# Altium project DataloggerV3.x_Mainboard.PrjPcb (part 2 of 2)

## Sheet Inverted_HS_LS_switch_HI_PWR.SchDoc: Data Logger - Inverted HS LS Hi Power Switches
size A4; DocumentNumber: DL-MB-10; Revision: 3.2.1B; SheetNumber: 10; SheetTotal: 11
Used 4 times, as channels Arduino_2560_schematics/ISA - Arduino Option Inverted Switches/ISA3, Arduino_2560_schematics/ISA - Arduino Option Inverted Switches/ISA4, Arduino_2560_schematics/ISA - Arduino Option Inverted Switches/ISA1, Arduino_2560_schematics/ISA - Arduino Option Inverted Switches/ISA2. Parts and nets are listed once, with the designators drawn on the sheet.
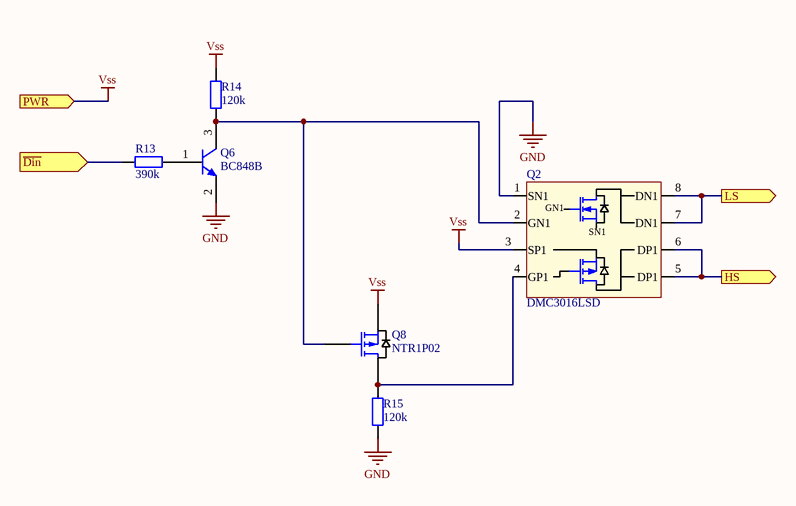
[diagram p7: Inverted_HS_LS_switch_HI_PWR.SchDoc]

### Parts
Q2  DMC3016LSD  [SOIC-8_SOIC127P600X175-8N]
Q6  BC848B  [SOT23_N]
Q8  NTR1P02  [SOT23_N]
R13  390k  [RES-1206_M]
R14  120k  [RES-1206_M]
R15  120k  [RES-1206_M]

### Ports
HS (out), LS (out), PWR (in), ~{Din} (in)

### Nets
GND: Q2.1(SN1) Q6.2(E) R15.2
Vss: Q2.3(SP1) Q8.2(S) R14.2 ; port PWR
~{Din}: R13.1 ; port ~{Din}
HS: Q2.5(DP1) Q2.6(DP1) ; port HS
LS: Q2.7(DN1) Q2.8(DN1) ; port LS
NetQ2_2: Q2.2(GN1) Q6.3(C) Q8.1(G) R14.1
NetQ2_4: Q2.4(GP1) Q8.3(D) R15.1
NetQ6_1: Q6.1(B) R13.2

### Channels
Arduino_2560_schematics/ISA - Arduino Option Inverted Switches/ISA3: designators Q2=ISA3.Q2 Q6=ISA3.Q6 Q8=ISA3.Q8 R13=ISA3.R13 R14=ISA3.R14 R15=ISA3.R15; ports HS=INV_5V12V_HS_3 LS=INV_5V12V_LS_3 PWR=5V ~{Din}=RSW3
Arduino_2560_schematics/ISA - Arduino Option Inverted Switches/ISA4: designators Q2=ISA4.Q2 Q6=ISA4.Q6 Q8=ISA4.Q8 R13=ISA4.R13 R14=ISA4.R14 R15=ISA4.R15; ports HS=INV_5V12V_HS_4 LS=INV_5V12V_LS_4 PWR=5V ~{Din}=RSW4
Arduino_2560_schematics/ISA - Arduino Option Inverted Switches/ISA1: designators Q2=ISA1.Q2 Q6=ISA1.Q6 Q8=ISA1.Q8 R13=ISA1.R13 R14=ISA1.R14 R15=ISA1.R15; ports HS=INV_5V12V_HS_1 LS=INV_5V12V_LS_1 PWR=5V ~{Din}=RSW1
Arduino_2560_schematics/ISA - Arduino Option Inverted Switches/ISA2: designators Q2=ISA2.Q2 Q6=ISA2.Q6 Q8=ISA2.Q8 R13=ISA2.R13 R14=ISA2.R14 R15=ISA2.R15; ports HS=INV_5V12V_HS_2 LS=INV_5V12V_LS_2 PWR=5V ~{Din}=RSW2

### Notes on the sheet
- Title
- Size
- Date:
- A4
- Number
- Time:
- Sheet
- of
- Revision
- File:
- Drawn By:

### Library data of the parts
Q2 = DMC3016LSD: MOSFET N/P-CH 30V 8.2A/6.2A 8SO; Manufacturer: Diodes; Manufacturer Part Number: DMC3016LSD-13; Continuous Drain Current (ID): 6.2A; Rds On Max: 16mR; Input Capacitance: 1.415nF; Max Power Dissipation: 1.2W; Number of Channels: 2; Drain to Source Resistance: 30mR; Gate to Source Voltage (Vgs): 20V; Fall Time: 40.4ns; Rise Time: 17.1ns; Turn-Off Delay Time: 60.5ns; Turn-On Delay Time: 9.7ns; FET Type: N and P-Channel; RoHS: Yes; Category: MOSFETs; Mount: Surface Mount; Case/Package: SOIC; Number of Pins: 8; Weight: 0.00261oz; Min Operating Temperature: -55°C; Max Operating Temperature: 150°C; Packaging: Tape and Reel; Drain to Source Voltage (Vdss): 30V; Drain to Source Breakdown Voltage: 30V; Package Quantity: 2500; Lead Free: Lead Free; RoHS Compliant: Yes; ComponentLink1URL: http://www.mouser.com/ds/2/115/DMC3016LSD-364397.pdf?src-supplier=Mouser; ComponentLink1Description: http://www.mouser.com/ds/2/115/DMC3016LSD-364397.pdf?src-supplier=Mouser; ComponentLink2URL: https://www.diodes.com/assets/Datasheets/DMC3016LSD.pdf?src-supplier=Digi-Key; ComponentLink2Description: https://www.diodes.com/assets/Datasheets/DMC3016LSD.pdf?src-supplier=Digi-Key
Q6 = BC848B: NPN Silicon AF Transistor, 30 V VCEO, 100 mA IC, SOT23, Reel, Green; Manufacturer: Infineon; fT (typ): 250 MHz; Green: TRUE; IBM (max): 200 mA; IC (max): 100 mA; ICBO (max): 15 nA; Ptot (max): 330 mW; VCBO (max): 30 V; VEBO (max): 6 V; PackageVersion: Apr-08; PackageReference: SOT23; PackageDescription: 3-Pin Small Outline Transistor Package, 1.3 x 2.9 mm Body, 0.95 mm Pitch; ICM (max): 200 mA; Packing: Reel; Polarity: NPN; VCEO (max): 30 V; Mounting Technology: Surface Mount; PartNumber: BC848B; ComponentLink1Description: Manufacturer URL; ComponentLink1URL: http://www.infineon.com/; ComponentLink2Description: Datasheet; ComponentLink2URL: http://www.infineon.com/dgdl/bc847series_bc848series_bc849series_bc850series.pdf?folderId=db3a304314dca389011541d30fa21656&fileId=db3a304314dca389011541d4630a1657; ComponentLink3Description: Package Specification; ComponentLink3URL: http://www.infineon.com/dgdl/SOT23-Package_Overview.pdf?folderId=db3a30431936bc4b0119532290053c66&fileId=db3a30431936bc4b0119533468123c85
Q8 = MOSFET-P: NTR1P02T1G P-channel MOSFET Transistor; 1 A; 20 V; 3-Pin SOT-23; Manufacturer: ON Semiconductor; Rise Time: 9ns; Continuous Drain Current (ID): 1A; Gate to Source Voltage (Vgs): 20V; Power Dissipation: 400mW; Drain to Source Resistance: 148mR; Element Configuration: Single; Drain to Source Breakdown Voltage: -20V; Rds On Max: 180mR; Input Capacitance: 165pF; Current Rating: -1A; Number of Elements: 1; Turn-On Delay Time: 7ns; Threshold Voltage: -1.9V; Manufacturer Part Number: NTR1P02; RoHS: Yes; Category: MOSFETs; Case/Package: SOT-23-3; Number of Pins: 3; Contact Plating: Tin,Matte; Min Operating Temperature: -55°C; Max Operating Temperature: 150°C; Fall Time: 9ns; Turn-Off Delay Time: 9ns; Package Quantity: 1; Packaging: Tape and Reel; Max Power Dissipation: 400mW; Voltage Rating (DC): -20V; Drain to Source Voltage (Vdss): 20V; On-State Resistance: 148MR; Nominal Vgs: -1.9V; Length: 2.9mm; Width: 1.3mm; Height: 0.94mm; Radiation Hardening: No; RoHS Compliant: Yes; Lead Free: Lead Free; REACH SVHC: No SVHC; ComponentLink1URL: https://datasheet.ciiva.com/22641/1708311-22641684.pdf?src-supplier=Element14; ComponentLink1Description: https://datasheet.ciiva.com/22641/1708311-22641684.pdf?src-supplier=Element14; ComponentLink2URL: https://datasheet.ciiva.com/936/ntr1p02t1-d-936864.pdf?src-supplier=Digi-Key; ComponentLink2Description: https://datasheet.ciiva.com/936/ntr1p02t1-d-936864.pdf?src-supplier=Digi-Key; ComponentLink3URL: https://datasheet.ciiva.com/22641/1708311-22641686.pdf?src-supplier=Element14; ComponentLink3Description: https://datasheet.ciiva.com/22641/1708311-22641686.pdf?src-supplier=Element14; ComponentLink4URL: https://datasheet.ciiva.com/16386/ntr1p02t1-d-16386335.pdf?src-supplier=Future+Electronics; ComponentLink4Description: https://datasheet.ciiva.com/16386/ntr1p02t1-d-16386335.pdf?src-supplier=Future+Electronics; ComponentLink5URL: https://datasheet.ciiva.com/26145/ntr1p02t1-d-26145674.pdf?src-supplier=Avnet+Europe; ComponentLink5Description: https://datasheet.ciiva.com/26145/ntr1p02t1-d-26145674.pdf?src-supplier=Avnet+Europe; ComponentLink6URL: https://datasheet.ciiva.com/11168/ntr1p02t1-d-11168174.pdf?src-supplier=Avnet; ComponentLink6Description: https://datasheet.ciiva.com/11168/ntr1p02t1-d-11168174.pdf?src-supplier=Avnet; ComponentLink7URL: https://datasheet.ciiva.com/936/ntr1p02t1-d-936865.pdf?src-supplier=Digi-Key; ComponentLink7Description: https://datasheet.ciiva.com/936/ntr1p02t1-d-936865.pdf?src-supplier=Digi-Key
R13-R15 = Res2: Resistor; Published: 8-Jun-2000; LatestRevisionDate: 17-Jul-2002; LatestRevisionNote: Re-released for DXP Platform.; PackageReference: 1206; Publisher: Altium Limited; PackageDescription: Chip Resistor 1206 Case Size
  R13: Value: 390k
  R14 R15: Value: 120k

## Sheet HS_LS_switch_HI_PWR.SchDoc: Data Logger - HS LS HI Power Switches
size A4; DocumentNumber: DL-MB-7; Revision: 3.2.1B; SheetNumber: 7; SheetTotal: 11
Used 2 times, as channels Arduino_2560_schematics/SAO1, Arduino_2560_schematics/SAO2. Parts and nets are listed once, with the designators drawn on the sheet.
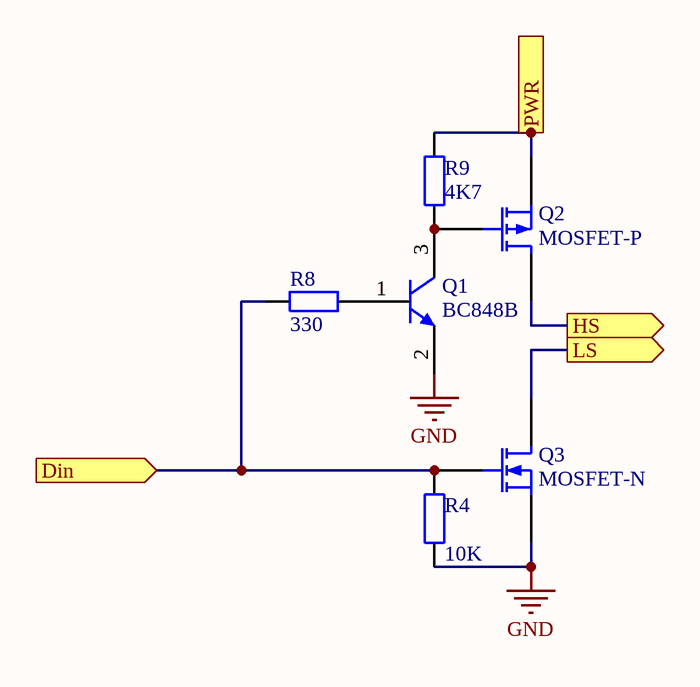
[diagram p8: HS_LS_switch_HI_PWR.SchDoc]

### Parts
Q1  BC848B  [SOT23_N]
Q2  MOSFET-P  [TO-220AB_PMOS_TABDOWN]
Q3  MOSFET-N  [TO-220AB_NMOS_TABDOWN]
R4  10K  [RES-1206_M]
R8  330  [RES-1206_M]
R9  4K7  [RES-1206_M]

### Ports
Din (in), HS (out), LS (out), PWR (in)

### Nets
GND: Q1.2(E) Q3.3(S) R4.1
Din: Q3.1(G) R4.2 R8.1 ; port Din
HS: Q2.2(D) ; port HS
LS: Q3.2(D) ; port LS
PWR: Q2.3(S) R9.2 ; port PWR
NetQ1_1: Q1.1(B) R8.2
NetQ1_3: Q1.3(C) Q2.1(G) R9.1

### Channels
Arduino_2560_schematics/SAO1: designators Q1=SAO1.Q1 Q2=SAO1.Q2 Q3=SAO1.Q3 R4=SAO1.R4 R8=SAO1.R8 R9=SAO1.R9; ports Din=D08 HS=5V12V_HS_1 LS=5V12V_LS_1 PWR=NetC13_1
Arduino_2560_schematics/SAO2: designators Q1=SAO2.Q1 Q2=SAO2.Q2 Q3=SAO2.Q3 R4=SAO2.R4 R8=SAO2.R8 R9=SAO2.R9; ports Din=D09 HS=5V12V_HS_2 LS=5V12V_LS_2 PWR=NetC12_1

### Notes on the sheet
- Title
- Size
- Date:
- A4
- Number
- Time:
- Sheet
- of
- Revision
- File:
- Drawn By:

### Library data of the parts
Q1 = BC848B: as Q6 on sheet Inverted_HS_LS_switch_HI_PWR; PackageVersion: Apr-08; PackageReference: SOT23; PackageDescription: 3-Pin Small Outline Transistor Package, 1.3 x 2.9 mm Body, 0.95 mm Pitch; ICM (max): 200 mA; Packing: Reel; Polarity: NPN; VCEO (max): 30 V; Mounting Technology: Surface Mount; PartNumber: BC848B; ComponentLink1Description: Manufacturer URL; ComponentLink1URL: http://www.infineon.com/; ComponentLink2Description: Datasheet; ComponentLink2URL: http://www.infineon.com/dgdl/bc847series_bc848series_bc849series_bc850series.pdf?folderId=db3a304314dca389011541d30fa21656&fileId=db3a304314dca389011541d4630a1657; ComponentLink3Description: Package Specification; ComponentLink3URL: http://www.infineon.com/dgdl/SOT23-Package_Overview.pdf?folderId=db3a30431936bc4b0119532290053c66&fileId=db3a30431936bc4b0119533468123c85
Q2 = MOSFET-P: P-Channel MOSFET; PackageVersion: 1995/1996; PackageReference: TO-220AB; PackageDescription: TO, Thru-Hole; 3 In-Line Leads; Pitch 2.54 mm
Q3 = MOSFET-N: N-Channel MOSFET; PackageVersion: 1995/1996; PackageReference: TO-220AB; PackageDescription: TO, Thru-Hole; 3 In-Line Leads; Pitch 2.54 mm
R4 R8 R9 = Res2: Resistor; Published: 8-Jun-2000; LatestRevisionDate: 17-Jul-2002; LatestRevisionNote: Re-released for DXP Platform.; PackageReference: 1206; Publisher: Altium Limited; PackageDescription: Chip Resistor 1206 Case Size
  R4: Value: 10K
  R8: Value: 330
  R9: Value: 4K7

## Sheet HS_Inverted-Normal_Switch_LOW_PWR.SchDoc: Data Logger - Inverted HS, Normal Switches
size A4; DocumentNumber: DL-MB-6; Revision: 3.2.1B; SheetNumber: 6; SheetTotal: 11
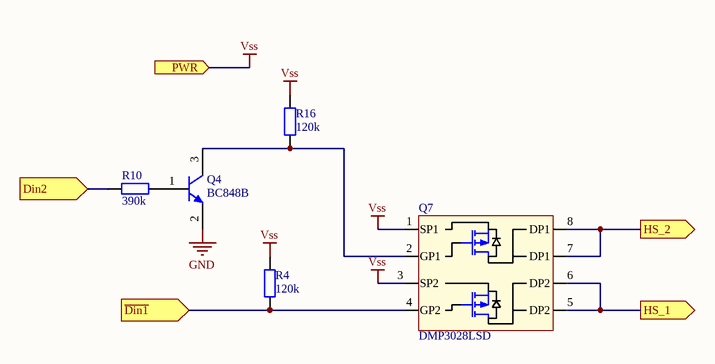
[diagram p9: HS_Inverted-Normal_Switch_LOW_PWR.SchDoc]

### Parts
Q4  BC848B  [SOT23_N]
Q7  DMP3028LSD  [SOIC-8_SOIC127P600X175-8N]
R4  120k  [RES-1206_M]
R10  390k  [RES-1206_M]
R16  120k  [RES-1206_M]

### Ports
Din2 (in), HS_1 (out), HS_2 (out), PWR (in), ~{Din1} (in)

### Nets
GND: Q4.2(E)
Vss: Q7.1(SP1) Q7.3(SP2) R4.2 R16.2 ; port PWR  [project net 5V]
D02: R10.1 ; port Din2
D07: Q7.4(GP2) R4.1 ; port ~{Din1}
HS_I2C_SW: Q7.5(DP2) Q7.6(DP2) ; port HS_1
NetC29_1: Q7.7(DP1) Q7.8(DP1) ; port HS_2
NetQ4_1: Q4.1(B) R10.2
NetQ4_3: Q4.3(C) Q7.2(GP1) R16.1

### Notes on the sheet
- Title
- Size
- Date:
- A4
- Number
- Time:
- Sheet
- of
- Revision
- File:
- Drawn By:

### Library data of the parts
Q4 = BC848B: as Q6 on sheet Inverted_HS_LS_switch_HI_PWR; PackageVersion: Apr-08; PackageReference: SOT23; PackageDescription: 3-Pin Small Outline Transistor Package, 1.3 x 2.9 mm Body, 0.95 mm Pitch; ICM (max): 200 mA; Packing: Reel; Polarity: NPN; VCEO (max): 30 V; Mounting Technology: Surface Mount; PartNumber: BC848B; ComponentLink1Description: Manufacturer URL; ComponentLink1URL: http://www.infineon.com/; ComponentLink2Description: Datasheet; ComponentLink2URL: http://www.infineon.com/dgdl/bc847series_bc848series_bc849series_bc850series.pdf?folderId=db3a304314dca389011541d30fa21656&fileId=db3a304314dca389011541d4630a1657; ComponentLink3Description: Package Specification; ComponentLink3URL: http://www.infineon.com/dgdl/SOT23-Package_Overview.pdf?folderId=db3a30431936bc4b0119532290053c66&fileId=db3a30431936bc4b0119533468123c85
Q7 = DMP3028LSD: MOSFET 2P-CH 30V 6A SO-8, VgMax=20V, Max Drain Resistance (38 mΩ); Manufacturer: Diodes; Manufacturer Part Number: DMP3028LSD-13; Rds On Max: 25mR; Input Capacitance: 1.241nF; Max Power Dissipation: 1.3W; RoHS: Yes; Category: MOSFETs; Mount: Surface Mount; Case/Package: SOIC; Min Operating Temperature: -55°C; Max Operating Temperature: 150°C; Packaging: Tape and Reel; Drain to Source Voltage (Vdss): 30V; Continuous Drain Current (ID): 6A; RoHS Compliant: Yes; ComponentLink1URL: http://www.mouser.com/ds/2/115/DMP3028LSD-776487.pdf?src-supplier=Mouser; ComponentLink1Description: http://www.mouser.com/ds/2/115/DMP3028LSD-776487.pdf?src-supplier=Mouser; ComponentLink2URL: https://www.diodes.com/assets/Datasheets/DMP3028LSD.pdf?src-supplier=Digi-Key; ComponentLink2Description: https://www.diodes.com/assets/Datasheets/DMP3028LSD.pdf?src-supplier=Digi-Key
R4 R10 R16 = Res2: Resistor; Published: 8-Jun-2000; LatestRevisionDate: 17-Jul-2002; LatestRevisionNote: Re-released for DXP Platform.; PackageReference: 1206; Publisher: Altium Limited; PackageDescription: Chip Resistor 1206 Case Size
  R4 R16: Value: 120k
  R10: Value: 390k

## Sheet Inverted_HS_switch_HI_PWR.SchDoc: Data Logger - Inverted HS Hi Power Switch
size A4; DocumentNumber: DL-MB-8; Revision: 3.2.1B; SheetNumber: 8; SheetTotal: 11
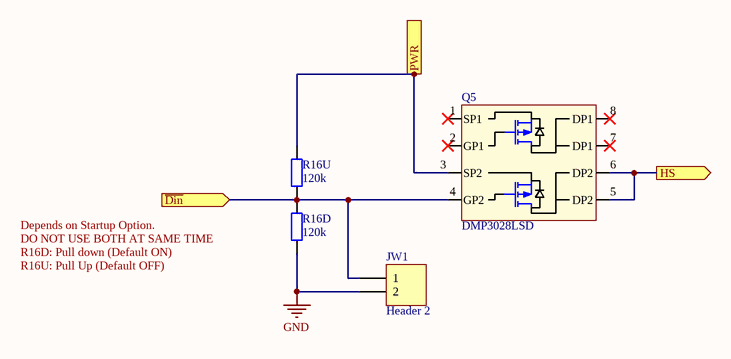
[diagram p10: Inverted_HS_switch_HI_PWR.SchDoc]

### Parts
JW1  Header 2  [HDR1X2]  (no BOM)
Q5  DMP3028LSD  [SOIC-8_SOIC127P600X175-8N]
R16D  120k  [RES-1206_M]
R16U  120k  [RES-1206_M]

### Ports
HS (out), PWR (in), ~{Din} (in)

### Nets
5V: Q5.3(SP2) R16U.2 ; port PWR
GND: JW1.2 R16D.1
D06: JW1.1 Q5.4(GP2) R16D.2 R16U.1 ; port ~{Din}
NetJ7_2: Q5.5(DP2) Q5.6(DP2) ; port HS

Not connected (* = marked no-connect by the designer): Q5 1(SP1)* 2(GP1)* 7(DP1)* 8(DP1)*

### Notes on the sheet
- Depends on Startup Option.
  DO NOT USE BOTH AT SAME TIME
  R16D: Pull down (Default ON)
  R16U: Pull Up (Default OFF)
- Title
- Size
- Date:
- A4
- Number
- Time:
- Sheet
- of
- Revision
- File:
- Drawn By:

### Library data of the parts
JW1 = Header 2: Header, 2-Pin, Optional short to GND for PFET; LatestRevisionDate: 17-Jul-2002; LatestRevisionNote: Re-released for DXP Platform.; Publisher: Altium Limited
Q5 = DMP3028LSD: as Q7 on sheet HS_Inverted-Normal_Switch_LOW_PWR; RoHS: Yes; Category: MOSFETs; Mount: Surface Mount; Case/Package: SOIC; Min Operating Temperature: -55°C; Max Operating Temperature: 150°C; Packaging: Tape and Reel; Drain to Source Voltage (Vdss): 30V; Continuous Drain Current (ID): 6A; RoHS Compliant: Yes; ComponentLink1URL: http://www.mouser.com/ds/2/115/DMP3028LSD-776487.pdf?src-supplier=Mouser; ComponentLink1Description: http://www.mouser.com/ds/2/115/DMP3028LSD-776487.pdf?src-supplier=Mouser; ComponentLink2URL: https://www.diodes.com/assets/Datasheets/DMP3028LSD.pdf?src-supplier=Digi-Key; ComponentLink2Description: https://www.diodes.com/assets/Datasheets/DMP3028LSD.pdf?src-supplier=Digi-Key
R16D R16U = Res2: Resistor; Published: 8-Jun-2000; LatestRevisionDate: 17-Jul-2002; LatestRevisionNote: Re-released for DXP Platform.; PackageReference: 1206; Publisher: Altium Limited; PackageDescription: Chip Resistor 1206 Case Size; Value: 120k

## Nets that join several sheets
3.3V: Top level (C31.1 H_ASW2P.4 VR1.5), RPI_schematics (J8.1)
5V: Top level (8 pins), RPI_schematics (J8.3), Arduino_schematics (23 pins), Arduino_2560_schematics/Arduino switches/SA1 (SA1.Q12.6 SA1.Q12.9), Arduino_2560_schematics/Arduino switches/SA2 (SA2.Q12.6 SA2.Q12.9), Arduino_2560_schematics/Arduino switches/SA3 (SA3.Q12.6 SA3.Q12.9), Arduino_2560_schematics/Arduino switches/SA4 (SA4.Q12.6 SA4.Q12.9), Arduino_2560_schematics/Arduino switches/SA5 (SA5.Q12.6 SA5.Q12.9), Arduino_2560_schematics/Arduino switches/SA9 (SA9.Q12.6 SA9.Q12.9), Arduino_2560_schematics/Arduino switches/SA10 (SA10.Q12.6 SA10.Q12.9), Arduino_2560_schematics/Arduino switches/SA11 (SA11.Q12.6 SA11.Q12.9), Arduino_2560_schematics/Arduino switches/SA12 (SA12.Q12.6 SA12.Q12.9), Arduino_2560_schematics/Arduino switches/SA13 (SA13.Q12.6 SA13.Q12.9), Arduino_2560_schematics/Arduino switches/SA14 (SA14.Q12.6 SA14.Q12.9), Arduino_2560_schematics/Arduino switches/SA6 (SA6.Q12.6 SA6.Q12.9), Arduino_2560_schematics/Arduino switches/SA7 (SA7.Q12.6 SA7.Q12.9), Arduino_2560_schematics/Arduino switches/SA8 (SA8.Q12.6 SA8.Q12.9), Arduino_2560_schematics/ISA - Arduino Option Inverted Switches/ISA3 (ISA3.Q2.3 ISA3.Q8.2 ISA3.R14.2), Arduino_2560_schematics/ISA - Arduino Option Inverted Switches/ISA4 (ISA4.Q2.3 ISA4.Q8.2 ISA4.R14.2), Arduino_2560_schematics/ISA - Arduino Option Inverted Switches/ISA1 (ISA1.Q2.3 ISA1.Q8.2 ISA1.R14.2), Arduino_2560_schematics/ISA - Arduino Option Inverted Switches/ISA2 (ISA2.Q2.3 ISA2.Q8.2 ISA2.R14.2), HS_Inverted-Normal_Switch_LOW_PWR (Q7.1 Q7.3 R4.2 R16.2), Inverted_HS_switch_HI_PWR (Q5.3 R16U.2)
12V: Top level (5 pins), Arduino_schematics (6 pins)
GND: Top level (21 pins), RPI_schematics (20 pins), RPi_schematics/pi_3.3V_5V_switches/SP1 (5 pins), RPi_schematics/pi_3.3V_5V_switches/SP2 (5 pins), RPi_schematics/pi_3.3V_5V_switches/SP3 (5 pins), RPi_schematics/pi_3.3V_5V_switches/SP4 (5 pins), Arduino_schematics (15 pins), Arduino_2560_schematics/Arduino switches/SA1 (5 pins), Arduino_2560_schematics/Arduino switches/SA2 (5 pins), Arduino_2560_schematics/Arduino switches/SA3 (5 pins), Arduino_2560_schematics/Arduino switches/SA4 (5 pins), Arduino_2560_schematics/Arduino switches/SA5 (5 pins), Arduino_2560_schematics/Arduino switches/SA9 (5 pins), Arduino_2560_schematics/Arduino switches/SA10 (5 pins), Arduino_2560_schematics/Arduino switches/SA11 (5 pins), Arduino_2560_schematics/Arduino switches/SA12 (5 pins), Arduino_2560_schematics/Arduino switches/SA13 (5 pins), Arduino_2560_schematics/Arduino switches/SA14 (5 pins), Arduino_2560_schematics/Arduino switches/SA6 (5 pins), Arduino_2560_schematics/Arduino switches/SA7 (5 pins), Arduino_2560_schematics/Arduino switches/SA8 (5 pins), Arduino_2560_schematics/ISA - Arduino Option Inverted Switches/ISA3 (ISA3.Q2.1 ISA3.Q6.2 ISA3.R15.2), Arduino_2560_schematics/ISA - Arduino Option Inverted Switches/ISA4 (ISA4.Q2.1 ISA4.Q6.2 ISA4.R15.2), Arduino_2560_schematics/ISA - Arduino Option Inverted Switches/ISA1 (ISA1.Q2.1 ISA1.Q6.2 ISA1.R15.2), Arduino_2560_schematics/ISA - Arduino Option Inverted Switches/ISA2 (ISA2.Q2.1 ISA2.Q6.2 ISA2.R15.2), Arduino_2560_schematics/SAO1 (SAO1.Q1.2 SAO1.Q3.3 SAO1.R4.1), Arduino_2560_schematics/SAO2 (SAO2.Q1.2 SAO2.Q3.3 SAO2.R4.1), HS_Inverted-Normal_Switch_LOW_PWR (Q4.2), Inverted_HS_switch_HI_PWR (JW1.2 R16D.1)
5V12V_HS_1: Top level (H_ASW2P.5), Arduino_2560_schematics/SAO1 (SAO1.Q2.2)
5V12V_HS_2: Top level (H_ASW2P.7), Arduino_schematics (J11.1), Arduino_2560_schematics/SAO2 (SAO2.Q2.2)
5V12V_LS_1: Top level (H_ASW2P.6), Arduino_2560_schematics/SAO1 (SAO1.Q3.2)
5V12V_LS_2: Top level (H_ASW2P.8), Arduino_schematics (J12.1), Arduino_2560_schematics/SAO2 (SAO2.Q3.2)
5V_HS_1: Top level (H_ASW1.2), Arduino_2560_schematics/Arduino switches/SA1 (SA1.Q12.7)
5V_HS_2: Top level (H_ASW1.4), Arduino_2560_schematics/Arduino switches/SA1 (SA1.Q12.10)
5V_HS_3: Top level (H_ASW1.6), Arduino_2560_schematics/Arduino switches/SA2 (SA2.Q12.7)
5V_HS_4: Top level (H_ASW1.8), Arduino_2560_schematics/Arduino switches/SA2 (SA2.Q12.10)
5V_HS_5: Top level (H_ASW1.10), Arduino_2560_schematics/Arduino switches/SA3 (SA3.Q12.7)
5V_HS_6: Top level (H_ASW1.12), Arduino_2560_schematics/Arduino switches/SA3 (SA3.Q12.10)
5V_HS_7: Top level (H_ASW1.14), Arduino_2560_schematics/Arduino switches/SA4 (SA4.Q12.7)
5V_HS_8: Top level (H_ASW1.16), Arduino_2560_schematics/Arduino switches/SA4 (SA4.Q12.10)
5V_HS_9: Top level (H_ASW1.18), Arduino_2560_schematics/Arduino switches/SA5 (SA5.Q12.7)
5V_HS_10: Top level (H_ASW1.20), Arduino_2560_schematics/Arduino switches/SA5 (SA5.Q12.10)
5V_HS_11: Top level (H_ASW1.22), Arduino_2560_schematics/Arduino switches/SA6 (SA6.Q12.7)
5V_HS_12: Top level (H_ASW1.24), Arduino_2560_schematics/Arduino switches/SA6 (SA6.Q12.10)
5V_HS_13: Top level (H_ASW1.26), Arduino_2560_schematics/Arduino switches/SA7 (SA7.Q12.7)
5V_HS_14: Top level (H_ASW1.28), Arduino_2560_schematics/Arduino switches/SA7 (SA7.Q12.10)
5V_HS_15: Top level (H_ASW1.30), Arduino_2560_schematics/Arduino switches/SA8 (SA8.Q12.7)
5V_HS_16: Top level (H_ASW1.32), Arduino_2560_schematics/Arduino switches/SA8 (SA8.Q12.10)
5V_HS_17: Top level (H_ASW1.34), Arduino_2560_schematics/Arduino switches/SA9 (SA9.Q12.7)
5V_HS_18: Top level (H_ASW1.36), Arduino_2560_schematics/Arduino switches/SA9 (SA9.Q12.10)
5V_HS_19: Top level (H_ASW1.38), Arduino_2560_schematics/Arduino switches/SA10 (SA10.Q12.7)
5V_HS_20: Top level (H_ASW1.40), Arduino_2560_schematics/Arduino switches/SA10 (SA10.Q12.10)
5V_HS_21: Top level (H_ASW1.42), Arduino_2560_schematics/Arduino switches/SA11 (SA11.Q12.7)
5V_HS_22: Top level (H_ASW1.44), Arduino_2560_schematics/Arduino switches/SA11 (SA11.Q12.10)
5V_HS_23: Top level (H_ASW1.46), Arduino_2560_schematics/Arduino switches/SA12 (SA12.Q12.7)
5V_HS_24: Top level (H_ASW1.48), Arduino_2560_schematics/Arduino switches/SA12 (SA12.Q12.10)
5V_HS_25: Top level (H_ASW1.50), Arduino_2560_schematics/Arduino switches/SA13 (SA13.Q12.7)
5V_HS_26: Top level (H_ASW1.52), Arduino_2560_schematics/Arduino switches/SA13 (SA13.Q12.10)
5V_HS_27: Top level (H_ASW1.54), Arduino_2560_schematics/Arduino switches/SA14 (SA14.Q12.7)
5V_HS_28: Top level (H_ASW1.56), Arduino_2560_schematics/Arduino switches/SA14 (SA14.Q12.10)
5V_LS_1: Top level (H_ASW1.1), Arduino_2560_schematics/Arduino switches/SA1 (SA1.Q12.8)
5V_LS_2: Top level (H_ASW1.3), Arduino_2560_schematics/Arduino switches/SA1 (SA1.Q12.11)
5V_LS_3: Top level (H_ASW1.5), Arduino_2560_schematics/Arduino switches/SA2 (SA2.Q12.8)
5V_LS_4: Top level (H_ASW1.7), Arduino_2560_schematics/Arduino switches/SA2 (SA2.Q12.11)
5V_LS_5: Top level (H_ASW1.9), Arduino_2560_schematics/Arduino switches/SA3 (SA3.Q12.8)
5V_LS_6: Top level (H_ASW1.11), Arduino_2560_schematics/Arduino switches/SA3 (SA3.Q12.11)
5V_LS_7: Top level (H_ASW1.13), Arduino_2560_schematics/Arduino switches/SA4 (SA4.Q12.8)
5V_LS_8: Top level (H_ASW1.15), Arduino_2560_schematics/Arduino switches/SA4 (SA4.Q12.11)
5V_LS_9: Top level (H_ASW1.17), Arduino_2560_schematics/Arduino switches/SA5 (SA5.Q12.8)
5V_LS_10: Top level (H_ASW1.19), Arduino_2560_schematics/Arduino switches/SA5 (SA5.Q12.11)
5V_LS_11: Top level (H_ASW1.21), Arduino_2560_schematics/Arduino switches/SA6 (SA6.Q12.8)
5V_LS_12: Top level (H_ASW1.23), Arduino_2560_schematics/Arduino switches/SA6 (SA6.Q12.11)
5V_LS_13: Top level (H_ASW1.25), Arduino_2560_schematics/Arduino switches/SA7 (SA7.Q12.8)
5V_LS_14: Top level (H_ASW1.27), Arduino_2560_schematics/Arduino switches/SA7 (SA7.Q12.11)
5V_LS_15: Top level (H_ASW1.29), Arduino_2560_schematics/Arduino switches/SA8 (SA8.Q12.8)
5V_LS_16: Top level (H_ASW1.31), Arduino_2560_schematics/Arduino switches/SA8 (SA8.Q12.11)
5V_LS_17: Top level (H_ASW1.33), Arduino_2560_schematics/Arduino switches/SA9 (SA9.Q12.8)
5V_LS_18: Top level (H_ASW1.35), Arduino_2560_schematics/Arduino switches/SA9 (SA9.Q12.11)
5V_LS_19: Top level (H_ASW1.37), Arduino_2560_schematics/Arduino switches/SA10 (SA10.Q12.8)
5V_LS_20: Top level (H_ASW1.39), Arduino_2560_schematics/Arduino switches/SA10 (SA10.Q12.11)
5V_LS_21: Top level (H_ASW1.41), Arduino_2560_schematics/Arduino switches/SA11 (SA11.Q12.8)
5V_LS_22: Top level (H_ASW1.43), Arduino_2560_schematics/Arduino switches/SA11 (SA11.Q12.11)
5V_LS_23: Top level (H_ASW1.45), Arduino_2560_schematics/Arduino switches/SA12 (SA12.Q12.8)
5V_LS_24: Top level (H_ASW1.47), Arduino_2560_schematics/Arduino switches/SA12 (SA12.Q12.11)
5V_LS_25: Top level (H_ASW1.49), Arduino_2560_schematics/Arduino switches/SA13 (SA13.Q12.8)
5V_LS_26: Top level (H_ASW1.51), Arduino_2560_schematics/Arduino switches/SA13 (SA13.Q12.11)
5V_LS_27: Top level (H_ASW1.53), Arduino_2560_schematics/Arduino switches/SA14 (SA14.Q12.8)
5V_LS_28: Top level (H_ASW1.55), Arduino_2560_schematics/Arduino switches/SA14 (SA14.Q12.11)
5V_SW1: Arduino_schematics (U1.D22), Arduino_2560_schematics/Arduino switches/SA1 (SA1.Q12.3 SA1.R12.1)
5V_SW2: Arduino_schematics (U1.D23), Arduino_2560_schematics/Arduino switches/SA1 (SA1.Q12.1 SA1.R11.1)
5V_SW3: Arduino_schematics (U1.D24), Arduino_2560_schematics/Arduino switches/SA2 (SA2.Q12.3 SA2.R12.1)
5V_SW4: Arduino_schematics (U1.D25), Arduino_2560_schematics/Arduino switches/SA2 (SA2.Q12.1 SA2.R11.1)
5V_SW5: Arduino_schematics (U1.D26), Arduino_2560_schematics/Arduino switches/SA3 (SA3.Q12.3 SA3.R12.1)
5V_SW6: Arduino_schematics (U1.D27), Arduino_2560_schematics/Arduino switches/SA3 (SA3.Q12.1 SA3.R11.1)
5V_SW7: Arduino_schematics (U1.D28), Arduino_2560_schematics/Arduino switches/SA4 (SA4.Q12.3 SA4.R12.1)
5V_SW8: Arduino_schematics (U1.D29), Arduino_2560_schematics/Arduino switches/SA4 (SA4.Q12.1 SA4.R11.1)
5V_SW9: Arduino_schematics (U1.D30), Arduino_2560_schematics/Arduino switches/SA5 (SA5.Q12.3 SA5.R12.1)
5V_SW10: Arduino_schematics (U1.D31), Arduino_2560_schematics/Arduino switches/SA5 (SA5.Q12.1 SA5.R11.1)
5V_SW11: Arduino_schematics (U1.D32), Arduino_2560_schematics/Arduino switches/SA6 (SA6.Q12.3 SA6.R12.1)
5V_SW12: Arduino_schematics (U1.D33), Arduino_2560_schematics/Arduino switches/SA6 (SA6.Q12.1 SA6.R11.1)
5V_SW13: Arduino_schematics (U1.D34), Arduino_2560_schematics/Arduino switches/SA7 (SA7.Q12.3 SA7.R12.1)
5V_SW14: Arduino_schematics (U1.D35), Arduino_2560_schematics/Arduino switches/SA7 (SA7.Q12.1 SA7.R11.1)
5V_SW15: Arduino_schematics (U1.D36), Arduino_2560_schematics/Arduino switches/SA8 (SA8.Q12.3 SA8.R12.1)
5V_SW16: Arduino_schematics (U1.D37), Arduino_2560_schematics/Arduino switches/SA8 (SA8.Q12.1 SA8.R11.1)
5V_SW17: Arduino_schematics (U1.D38), Arduino_2560_schematics/Arduino switches/SA9 (SA9.Q12.3 SA9.R12.1)
5V_SW18: Arduino_schematics (U1.D39), Arduino_2560_schematics/Arduino switches/SA9 (SA9.Q12.1 SA9.R11.1)
5V_SW19: Arduino_schematics (U1.D40), Arduino_2560_schematics/Arduino switches/SA10 (SA10.Q12.3 SA10.R12.1)
5V_SW20: Arduino_schematics (U1.D41), Arduino_2560_schematics/Arduino switches/SA10 (SA10.Q12.1 SA10.R11.1)
5V_SW21: Arduino_schematics (U1.D42), Arduino_2560_schematics/Arduino switches/SA11 (SA11.Q12.3 SA11.R12.1)
5V_SW22: Arduino_schematics (U1.D43), Arduino_2560_schematics/Arduino switches/SA11 (SA11.Q12.1 SA11.R11.1)
5V_SW23: Arduino_schematics (U1.D44), Arduino_2560_schematics/Arduino switches/SA12 (SA12.Q12.3 SA12.R12.1)
5V_SW24: Arduino_schematics (U1.D45), Arduino_2560_schematics/Arduino switches/SA12 (SA12.Q12.1 SA12.R11.1)
5V_SW25: Arduino_schematics (U1.D46), Arduino_2560_schematics/Arduino switches/SA13 (SA13.Q12.3 SA13.R12.1)
5V_SW26: Arduino_schematics (U1.D47), Arduino_2560_schematics/Arduino switches/SA13 (SA13.Q12.1 SA13.R11.1)
5V_SW27: Arduino_schematics (U1.D48), Arduino_2560_schematics/Arduino switches/SA14 (SA14.Q12.3 SA14.R12.1)
5V_SW28: Arduino_schematics (U1.D49), Arduino_2560_schematics/Arduino switches/SA14 (SA14.Q12.1 SA14.R11.1)
A-RX <> P-TX: Top level (H_PIO.18 J9.3), RPI_schematics (Rpi_GPIO1.8)
A-TX <> P-RX: Top level (H_PIO.16 J10.3), RPI_schematics (Rpi_GPIO1.10)
A_RX0: Top level (R7.2), Arduino_schematics (U1.D0)
A_RX1: Top level (H_ACOMS.6), Arduino_schematics (U1.D19)
A_RX2: Top level (H_ACOMS.4), Arduino_schematics (U1.D17)
A_RX3: Top level (H_ACOMS.2), Arduino_schematics (U1.D15)
A_TX0: Top level (R5.1), Arduino_schematics (U1.D1)
A_TX1: Top level (H_ACOMS.5), Arduino_schematics (U1.D18)
A_TX2: Top level (H_ACOMS.3), Arduino_schematics (U1.D16)
A_TX3: Top level (H_ACOMS.1), Arduino_schematics (U1.D14)
AD0: Top level (DHT1.2 H_AIO.2), Arduino_schematics (U1.A0/D54)
AD1: Top level (H_AIO.1), Arduino_schematics (U1.A1/D55)
AD2: Top level (H_AIO.4), Arduino_schematics (U1.A2/D56)
AD3: Top level (H_AIO.3), Arduino_schematics (U1.A3/D57)
AD4: Top level (H_AIO.6), Arduino_schematics (U1.A4/D58)
AD5: Top level (H_AIO.5), Arduino_schematics (U1.A5/D59)
AD6: Top level (H_AIO.8), Arduino_schematics (U1.A6/D60)
AD7: Top level (H_AIO.7), Arduino_schematics (U1.A7/D61)
AD8: Top level (H_AIO.10), Arduino_schematics (U1.A8/D62)
AD9: Top level (H_AIO.9), Arduino_schematics (U1.A9/D63)
AD10: Top level (H_AIO.12), Arduino_schematics (U1.A10/D64)
AD11: Top level (H_AIO.11), Arduino_schematics (U1.A11/D65)
AD12: Top level (H_AIO.14), Arduino_schematics (U1.A12/D66)
AD13: Top level (H_AIO.13), Arduino_schematics (U1.A13/D67)
AD14: Top level (H_AIO.16), Arduino_schematics (U1.A14/D68)
AD15: Top level (H_AIO.15), Arduino_schematics (R2.1 R3.2 U1.A15/D69)
ard_scl_21: Top level (H_ACOMS.8 R24.2 U2.22), Arduino_schematics (U1.D21)
ard_sda_20: Top level (H_ACOMS.7 R23.2 U2.23), Arduino_schematics (U1.D20)
D02: Arduino_schematics (U1.D2), HS_Inverted-Normal_Switch_LOW_PWR (R10.1)
D06: Arduino_schematics (U1.D6), Inverted_HS_switch_HI_PWR (JW1.1 Q5.4 R16D.2 R16U.1)
D07: Arduino_schematics (U1.D7), HS_Inverted-Normal_Switch_LOW_PWR (Q7.4 R4.1)
D08: Arduino_schematics (U1.D8), Arduino_2560_schematics/SAO1 (SAO1.Q3.1 SAO1.R4.2 SAO1.R8.1)
D09: Arduino_schematics (U1.D9), Arduino_2560_schematics/SAO2 (SAO2.Q3.1 SAO2.R4.2 SAO2.R8.1)
HS_I2C_SW: Top level (5 pins), HS_Inverted-Normal_Switch_LOW_PWR (Q7.5 Q7.6)
INV_5V12V_HS_1: Top level (H_ASW2P.15), Arduino_2560_schematics/ISA - Arduino Option Inverted Switches/ISA1 (ISA1.Q2.5 ISA1.Q2.6)
INV_5V12V_HS_2: Top level (H_ASW2P.13), Arduino_2560_schematics/ISA - Arduino Option Inverted Switches/ISA2 (ISA2.Q2.5 ISA2.Q2.6)
INV_5V12V_HS_3: Top level (H_ASW2P.11), Arduino_2560_schematics/ISA - Arduino Option Inverted Switches/ISA3 (ISA3.Q2.5 ISA3.Q2.6)
INV_5V12V_HS_4: Top level (H_ASW2P.9), Arduino_2560_schematics/ISA - Arduino Option Inverted Switches/ISA4 (ISA4.Q2.5 ISA4.Q2.6)
INV_5V12V_LS_1: Top level (H_ASW2P.16), Arduino_2560_schematics/ISA - Arduino Option Inverted Switches/ISA1 (ISA1.Q2.7 ISA1.Q2.8)
INV_5V12V_LS_2: Top level (H_ASW2P.14), Arduino_2560_schematics/ISA - Arduino Option Inverted Switches/ISA2 (ISA2.Q2.7 ISA2.Q2.8)
INV_5V12V_LS_3: Top level (H_ASW2P.12), Arduino_2560_schematics/ISA - Arduino Option Inverted Switches/ISA3 (ISA3.Q2.7 ISA3.Q2.8)
INV_5V12V_LS_4: Top level (H_ASW2P.10), Arduino_2560_schematics/ISA - Arduino Option Inverted Switches/ISA4 (ISA4.Q2.7 ISA4.Q2.8)
MISO: Top level (H_ACOMS.13), Arduino_schematics (U1.D50)
MOSI: Top level (H_ACOMS.14), Arduino_schematics (U1.D51)
NetC12_1: Arduino_schematics (C12.1 J6.2), Arduino_2560_schematics/SAO2 (SAO2.Q2.3 SAO2.R9.2)
NetC13_1: Arduino_schematics (C13.1 J5.2), Arduino_2560_schematics/SAO1 (SAO1.Q2.3 SAO1.R9.2)
NetC17_1: RPI_schematics (6 pins), RPi_schematics/pi_3.3V_5V_switches/SP1 (SP1.Q12.6 SP1.Q12.9), RPi_schematics/pi_3.3V_5V_switches/SP2 (SP2.Q12.6 SP2.Q12.9), RPi_schematics/pi_3.3V_5V_switches/SP3 (SP3.Q12.6 SP3.Q12.9), RPi_schematics/pi_3.3V_5V_switches/SP4 (SP4.Q12.6 SP4.Q12.9)
NetC29_1: Top level (C29.1 DHT1.1), HS_Inverted-Normal_Switch_LOW_PWR (Q7.7 Q7.8)
NetJ7_2: Top level (J7.2), Inverted_HS_switch_HI_PWR (Q5.5 Q5.6)
PI_3: Top level (H_PIO.15), RPI_schematics (Rpi_GPIO1.3)
PI_5: Top level (H_PIO.14), RPI_schematics (Rpi_GPIO1.5)
PI_11: Top level (H_PIO.12), RPI_schematics (Rpi_GPIO1.11)
PI_12: Top level (H_PIO.13), RPI_schematics (Rpi_GPIO1.12)
PI_13: RPI_schematics (Rpi_GPIO1.13), Arduino_schematics (C1.1 R1.1 U1.RST@1)
PI_19: Top level (H_PIO.11), RPI_schematics (Rpi_GPIO1.19)
PI_21: Top level (H_PIO.9), RPI_schematics (Rpi_GPIO1.21)
PI_23: Top level (H_PIO.7), RPI_schematics (Rpi_GPIO1.23)
PI_24: Top level (H_PIO.10), RPI_schematics (Rpi_GPIO1.24)
PI_26: Top level (H_PIO.8), RPI_schematics (Rpi_GPIO1.26)
PI_32: Top level (H_PIO.6), RPI_schematics (Rpi_GPIO1.32)
PI_33: Top level (H_PIO.5 J10.1), RPI_schematics (Rpi_GPIO1.33)
PI_35: Top level (H_PIO.3), RPI_schematics (Rpi_GPIO1.35)
PI_36: Top level (H_PIO.4 J9.1), RPI_schematics (Rpi_GPIO1.36)
PI_38: Top level (H_PIO.2), RPI_schematics (Rpi_GPIO1.38)
PI_40: Top level (H_PIO.1), RPI_schematics (Rpi_GPIO1.40)
PI_HS_1: Top level (H_PSW.1), RPi_schematics/pi_3.3V_5V_switches/SP1 (SP1.Q12.7)
PI_HS_2: Top level (H_PSW.3), RPi_schematics/pi_3.3V_5V_switches/SP1 (SP1.Q12.10)
PI_HS_3: Top level (H_PSW.5), RPi_schematics/pi_3.3V_5V_switches/SP2 (SP2.Q12.7)
PI_HS_4: Top level (H_PSW.7), RPi_schematics/pi_3.3V_5V_switches/SP2 (SP2.Q12.10)
PI_HS_5: Top level (H_PSW.9), RPi_schematics/pi_3.3V_5V_switches/SP3 (SP3.Q12.7)
PI_HS_6: Top level (H_PSW.11), RPi_schematics/pi_3.3V_5V_switches/SP3 (SP3.Q12.10)
PI_HS_7: Top level (H_PSW.13), RPi_schematics/pi_3.3V_5V_switches/SP4 (SP4.Q12.7)
PI_HS_8: Top level (H_PSW.15), RPi_schematics/pi_3.3V_5V_switches/SP4 (SP4.Q12.10)
PI_LS_1: Top level (H_PSW.2), RPi_schematics/pi_3.3V_5V_switches/SP1 (SP1.Q12.8)
PI_LS_2: Top level (H_PSW.4), RPi_schematics/pi_3.3V_5V_switches/SP1 (SP1.Q12.11)
PI_LS_3: Top level (H_PSW.6), RPi_schematics/pi_3.3V_5V_switches/SP2 (SP2.Q12.8)
PI_LS_4: Top level (H_PSW.8), RPi_schematics/pi_3.3V_5V_switches/SP2 (SP2.Q12.11)
PI_LS_5: Top level (H_PSW.10), RPi_schematics/pi_3.3V_5V_switches/SP3 (SP3.Q12.8)
PI_LS_6: Top level (H_PSW.12), RPi_schematics/pi_3.3V_5V_switches/SP3 (SP3.Q12.11)
PI_LS_7: Top level (H_PSW.14), RPi_schematics/pi_3.3V_5V_switches/SP4 (SP4.Q12.8)
PI_LS_8: Top level (H_PSW.16), RPi_schematics/pi_3.3V_5V_switches/SP4 (SP4.Q12.11)
PI_SW1: RPI_schematics (Rpi_GPIO1.37), RPi_schematics/pi_3.3V_5V_switches/SP1 (SP1.Q12.3 SP1.R12.1)
PI_SW2: RPI_schematics (Rpi_GPIO1.31), RPi_schematics/pi_3.3V_5V_switches/SP1 (SP1.Q12.1 SP1.R11.1)
PI_SW3: RPI_schematics (Rpi_GPIO1.29), RPi_schematics/pi_3.3V_5V_switches/SP2 (SP2.Q12.3 SP2.R12.1)
PI_SW4: RPI_schematics (Rpi_GPIO1.22), RPi_schematics/pi_3.3V_5V_switches/SP2 (SP2.Q12.1 SP2.R11.1)
PI_SW5: RPI_schematics (Rpi_GPIO1.18), RPi_schematics/pi_3.3V_5V_switches/SP3 (SP3.Q12.3 SP3.R12.1)
PI_SW6: RPI_schematics (Rpi_GPIO1.15), RPi_schematics/pi_3.3V_5V_switches/SP3 (SP3.Q12.1 SP3.R11.1)
PI_SW7: RPI_schematics (Rpi_GPIO1.16), RPi_schematics/pi_3.3V_5V_switches/SP4 (SP4.Q12.3 SP4.R12.1)
PI_SW8: RPI_schematics (Rpi_GPIO1.7), RPi_schematics/pi_3.3V_5V_switches/SP4 (SP4.Q12.1 SP4.R11.1)
PWM1: Top level (H_ACOMS.12), Arduino_schematics (U1.D4)
PWM2: Top level (H_ACOMS.10), Arduino_schematics (U1.D3)
rpi_5v_1: Top level (J7.1), RPI_schematics (5 pins)
RSW1: Arduino_schematics (U1.D10), Arduino_2560_schematics/ISA - Arduino Option Inverted Switches/ISA1 (ISA1.R13.1)
RSW2: Arduino_schematics (U1.D11), Arduino_2560_schematics/ISA - Arduino Option Inverted Switches/ISA2 (ISA2.R13.1)
RSW3: Arduino_schematics (U1.D12), Arduino_2560_schematics/ISA - Arduino Option Inverted Switches/ISA3 (ISA3.R13.1)
RSW4: Arduino_schematics (U1.D13), Arduino_2560_schematics/ISA - Arduino Option Inverted Switches/ISA4 (ISA4.R13.1)
SCK: Top level (H_ACOMS.15), Arduino_schematics (U1.D52)
SS: Top level (H_ACOMS.16), Arduino_schematics (U1.D53)
SSDI-12: Top level (H_ACOMS.9), Arduino_schematics (U1.D5)

## Assembly variants
RPI Default On: not fitted C1 C2 C4 C6 C14 C16 C17 C19 C20 C21 C23 C24 C26 C27 C29 R1 R16U
RPI Default Off: not fitted C1 C2 C4 C6 C14 C16 C17 C19 C20 C21 C23 C24 C26 C27 C29 R1 R16D